# EAGLE design SmoothieDriver-DC3 (EAGLE 6.3)
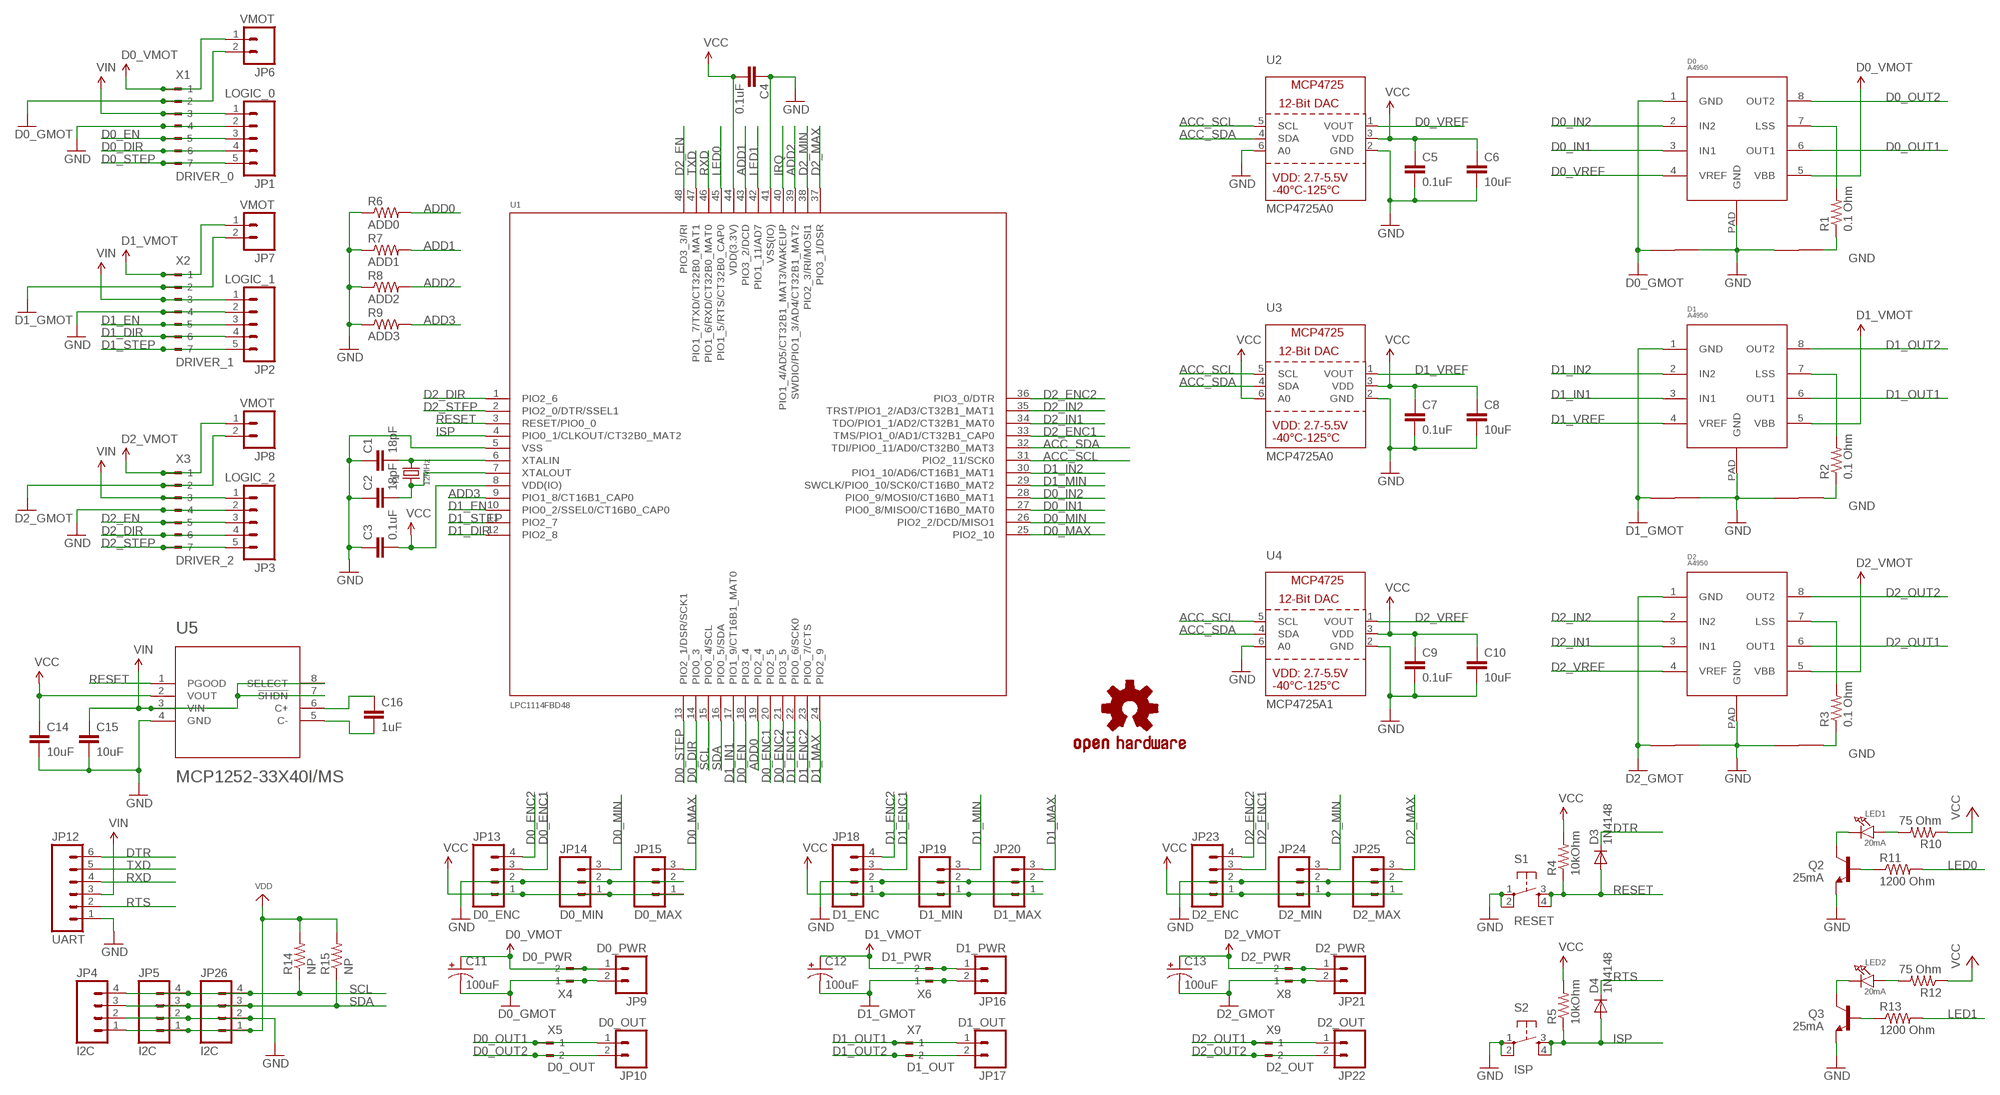
[diagram p0: schematic, sheet 1]

## Parts
C1  18pF  CAP0603-CAP  [0603-CAP]
C2  18pF  CAP0603-CAP  [0603-CAP]
C3  0.1uF  CAP0603-CAP  [0603-CAP]
C4  0.1uF  CAP0603-CAP  [0603-CAP]
C5  0.1uF  CAP0603-CAP  [0603-CAP]
C6  10uF  CAP0603-CAP  [0603-CAP]
C7  0.1uF  CAP0603-CAP  [0603-CAP]
C8  10uF  CAP0603-CAP  [0603-CAP]
C9  0.1uF  CAP0603-CAP  [0603-CAP]
C10  10uF  CAP0603-CAP  [0603-CAP]
C11  100uF  CAP_POLE  [PANASONIC_E]
C12  100uF  CAP_POLE  [PANASONIC_E]
C13  100uF  CAP_POLE  [PANASONIC_E]
C14  10uF  CAP1206  [1206]
C15  10uF  CAP1206  [1206]
C16  1uF  CAP0805  [0805]
D0  A4950  [SOICN8-PAD]
D0_GMOT  NET_LINK  [NET_LINK]
D1  A4950  [SOICN8-PAD]
D2  A4950  [SOICN8-PAD]
D3  1N4148  DIODESOD523  [SOD523]
D4  1N4148  DIODESOD523  [SOD523]
JP1  LOGIC_0  M05PTH  [1X05]
JP2  LOGIC_1  M05PTH  [1X05]
JP3  LOGIC_2  M05PTH  [1X05]
JP4  I2C  M04PTH  [1X04]
JP5  I2C  M04PTH  [1X04]
JP6  VMOT  M02PTH  [1X02]
JP7  VMOT  M02PTH  [1X02]
JP8  VMOT  M02PTH  [1X02]
JP9  D0_PWR  M02PTH  [1X02]
JP10  D0_OUT  M02PTH  [1X02]
JP12  UART  M06SIP  [1X06]
JP13  D0_ENC  M04PTH  [1X04]
JP14  D0_MIN  M03PTH  [1X03]
JP15  D0_MAX  M03PTH  [1X03]
JP16  D1_PWR  M02PTH  [1X02]
JP17  D1_OUT  M02PTH  [1X02]
JP18  D1_ENC  M04PTH  [1X04]
JP19  D1_MIN  M03PTH  [1X03]
JP20  D1_MAX  M03PTH  [1X03]
JP21  D2_PWR  M02PTH  [1X02]
JP22  D2_OUT  M02PTH  [1X02]
JP23  D2_ENC  M04PTH  [1X04]
JP24  D2_MIN  M03PTH  [1X03]
JP25  D2_MAX  M03PTH  [1X03]
JP26  I2C  M04PTH  [1X04]
LED1  20mA  LED0805  [CHIPLED_0805]
LED2  20mA  LED0805  [CHIPLED_0805]
Q2  25mA  TRANSISTOR_NPNSOT23  [SOT23]
Q3  25mA  TRANSISTOR_NPNSOT23  [SOT23]
R1  0.1 Ohm  RESISTOR2512  [R2512]
R2  0.1 Ohm  RESISTOR2512  [R2512]
R3  0.1 Ohm  RESISTOR2512  [R2512]
R4  10kOhm  RESISTOR0603-RES  [0603-RES]
R5  10kOhm  RESISTOR0603-RES  [0603-RES]
R6  ADD0  RESISTOR0603-RES  [0603-RES]
R7  ADD1  RESISTOR0603-RES  [0603-RES]
R8  ADD2  RESISTOR0603-RES  [0603-RES]
R9  ADD3  RESISTOR0603-RES  [0603-RES]
R10  75 Ohm  R-US_R0603  [R0603]
R11  1200 Ohm  R-US_R0603  [R0603]
R12  75 Ohm  R-US_R0603  [R0603]
R13  1200 Ohm  R-US_R0603  [R0603]
R14  NP  RESISTOR0603-RES  [0603-RES]
R15  NP  RESISTOR0603-RES  [0603-RES]
S1  RESET  TAC_SWITCHSMD  [TACTILE_SWITCH_SMD]
S2  ISP  TAC_SWITCHSMD  [TACTILE_SWITCH_SMD]
U1  LPC1114FBD48  LPC1113/4_QFP_SQUARE  [LQFP48]
U2  MCP4725A0  DAC_MCP4725  [SOT23-6]
U3  MCP4725A0  DAC_MCP4725  [SOT23-6]
U4  MCP4725A1  DAC_MCP4725  [SOT23-6]
U5  MCP1252-33X40I/MS  MCP1253  [MSOP8_0.65MM]
U$15  OSHW-LOGOM  [OSHW-LOGO-M]
U$22  NET_LINK  [NET_LINK]
U$23  NET_LINK  [NET_LINK]
U$24  NET_LINK  [NET_LINK]
U$25  NET_LINK  [NET_LINK]
U$26  NET_LINK  [NET_LINK]
X1  DRIVER_0  180-7  [180-7]
X2  DRIVER_1  180-7  [180-7]
X3  DRIVER_2  180-7  [180-7]
X4  D0_PWR  180-2  [180-2]
X5  D0_OUT  180-2  [180-2]
X6  D1_PWR  180-2  [180-2]
X7  D1_OUT  180-2  [180-2]
X8  D2_PWR  180-2  [180-2]
X9  D2_OUT  180-2  [180-2]
Y1  12MHz  CRYSTALTHIN  [CRYSTAL_3.2X2.5]

## Nets
ACC_SCL: U1.31(PIO2_11/SCK0) U2.5(SCL) U3.5(SCL) U4.5(SCL)
ACC_SDA: U1.32(TDI/PIO0_11/AD0/CT32B0_MAT3) U2.4(SDA) U3.4(SDA) U4.4(SDA)
ADD0: R6.2 U1.19(PIO2_4)
ADD1: R7.2 U1.43(PIO3_2/DCD)
ADD2: R8.2 U1.39(SWDIO/PIO1_3/AD4/CT32B1_MAT2)
ADD3: R9.2 U1.9(PIO1_8/CT16B1_CAP0)
D0_DIR: JP1.4 U1.14(PIO0_3) X1.6
D0_EN: JP1.3 U1.18(PIO3_4) X1.5
D0_ENC1: JP13.3 U1.20(PIO2_5)
D0_ENC2: JP13.4 U1.21(PIO3_5)
D0_GMOT: C11.- D0.1(GND) D0_GMOT.P$1 JP6.2 JP9.2 X1.2 X4.1
D0_IN1: D0.3(IN1) U1.27(PIO0_8/MISO0/CT16B0_MAT0)
D0_IN2: D0.2(IN2) U1.28(PIO0_9/MOSI0/CT16B0_MAT1)
D0_LSS: D0.7(LSS) R1.2
D0_MAX: JP15.3 U1.25(PIO2_10)
D0_MIN: JP14.3 U1.26(PIO2_2/DCD/MISO1)
D0_OUT1: D0.6(OUT1) JP10.1 X5.1
D0_OUT2: D0.8(OUT2) JP10.2 X5.2
D0_STEP: JP1.5 U1.13(PIO2_1/DSR/SCK1) X1.7
D0_VMOT: C11.+ D0.5(VBB) JP6.1 JP9.1 X1.1 X4.2
D0_VREF: D0.4(VREF) U2.1(VOUT)
D1_DIR: JP2.4 U1.12(PIO2_8) X2.6
D1_EN: JP2.3 U1.10(PIO0_2/SSEL0/CT16B0_CAP0) X2.5
D1_ENC1: JP18.3 U1.22(PIO0_6/SCK0)
D1_ENC2: JP18.4 U1.23(PIO0_7/CTS)
D1_GMOT: C12.- D1.1(GND) JP7.2 JP16.2 U$23.P$1 X2.2 X6.1
D1_IN1: D1.3(IN1) U1.17(PIO1_9/CT16B1_MAT0)
D1_IN2: D1.2(IN2) U1.30(PIO1_10/AD6/CT16B1_MAT1)
D1_LSS: D1.7(LSS) R2.2
D1_LSS1: D2.7(LSS) R3.2
D1_MAX: JP20.3 U1.24(PIO2_9)
D1_MIN: JP19.3 U1.29(SWCLK/PIO0_10/SCK0/CT16B0_MAT2)
D1_OUT1: D1.6(OUT1) JP17.1 X7.1
D1_OUT2: D1.8(OUT2) JP17.2 X7.2
D1_STEP: JP2.5 U1.11(PIO2_7) X2.7
D1_VMOT: C12.+ D1.5(VBB) JP7.1 JP16.1 X2.1 X6.2
D1_VREF: D1.4(VREF) U3.1(VOUT)
D2_DIR: JP3.4 U1.1(PIO2_6) X3.6
D2_EN: JP3.3 U1.48(PIO3_3/RI) X3.5
D2_ENC1: JP23.3 U1.33(TMS/PIO1_0/AD1/CT32B1_CAP0)
D2_ENC2: JP23.4 U1.36(PIO3_0/DTR)
D2_GMOT: C13.- D2.1(GND) JP8.2 JP21.2 U$26.P$1 X3.2 X8.1
D2_IN1: D2.3(IN1) U1.34(TDO/PIO1_1/AD2/CT32B1_MAT0)
D2_IN2: D2.2(IN2) U1.35(TRST/PIO1_2/AD3/CT32B1_MAT1)
D2_MAX: JP25.3 U1.37(PIO3_1/DSR)
D2_MIN: JP24.3 U1.38(PIO2_3/RI/MOSI1)
D2_OUT1: D2.6(OUT1) JP22.1 X9.1
D2_OUT2: D2.8(OUT2) JP22.2 X9.2
D2_STEP: JP3.5 U1.2(PIO2_0/DTR/SSEL1) X3.7
D2_VMOT: C13.+ D2.5(VBB) JP8.1 JP21.1 X3.1 X8.2
D2_VREF: D2.4(VREF) U4.1(VOUT)
DTR: D3.C JP12.6
GND: C1.1 C2.1 C3.1 C4.1 C5.2 C6.2 C7.2 C8.2 C9.2 C10.2 C14.2 C15.2 D0.PAD(GND) D0_GMOT.P$2 D1.PAD(GND) D2.PAD(GND) JP1.2 JP2.2 JP3.2 JP4.2 JP5.2 JP12.1 JP13.2 JP14.2 JP15.2 JP18.2 JP19.2 JP20.2 JP23.2 JP24.2 JP25.2 JP26.2 Q2.2(E) Q3.2(E) R1.1 R2.1 R3.1 R6.1 R7.1 R8.1 R9.1 S1.1 S1.2 S2.1 S2.2 U1.5(VSS) U1.41(VSS(IO)) U2.2(GND) U2.6(A0) U3.2(GND) U4.2(GND) U4.6(A0) U5.4(GND) U$22.P$1 U$22.P$2 U$23.P$2 U$24.P$1 U$24.P$2 U$25.P$1 U$25.P$2 U$26.P$2 X1.4 X2.4 X3.4
IRQ: U1.40(PIO1_4/AD5/CT32B1_MAT3/WAKEUP)
ISP: D4.A R5.1 S2.3 S2.4 U1.4(PIO0_1/CLKOUT/CT32B0_MAT2)
LED0: R11.2 U1.45(PIO1_5/RTS/CT32B0_CAP0)
LED1: R13.2 U1.42(PIO1_11/AD7)
N$1: LED1.A R10.2
N$2: LED1.C Q2.3(C)
N$6: Q2.1(B) R11.1
N$7: Q3.1(B) R13.1
N$9: LED2.A R12.2
N$10: LED2.C Q3.3(C)
PWRREG_C+: C16.1 U5.6(C+)
PWRREG_C-: C16.2 U5.5(C-)
RESET: D3.A R4.1 S1.3 S1.4 U1.3(RESET/PIO0_0) U5.1(PGOOD)
RTS: D4.C JP12.2
RXD: JP12.4 U1.46(PIO1_6/RXD/CT32B0_MAT0)
SCL: JP4.4 JP5.4 JP26.4 R14.1 U1.15(PIO0_4/SCL)
SDA: JP4.3 JP5.3 JP26.3 R15.1 U1.16(PIO0_5/SDA)
TXD: JP12.5 U1.47(PIO1_7/TXD/CT32B0_MAT1)
VCC: C3.2 C4.2 C5.1 C6.1 C7.1 C8.1 C9.1 C10.1 C14.1 JP13.1 JP14.1 JP15.1 JP18.1 JP19.1 JP20.1 JP23.1 JP24.1 JP25.1 R4.2 R5.2 R10.1 R12.1 U1.8(VDD(IO)) U1.44(VDD(3.3V)) U2.3(VDD) U3.3(VDD) U3.6(A0) U4.3(VDD) U5.2(VOUT)
VDD: JP4.1 JP5.1 JP26.1 R14.2 R15.2
VIN: C15.1 JP1.1 JP2.1 JP3.1 JP12.3 U5.3(VIN) U5.7(!SHDN) U5.8(SELECT) X1.3 X2.3 X3.3
XTALIN: C1.2 U1.6(XTALIN) Y1.2
XTALOUT: C2.2 U1.7(XTALOUT) Y1.1

## Library data of the parts
C1-C10 C14-C16 = SparkFun-Capacitors:CAP: Capacitor Standard 0603 ceramic capacitor, and 0.1" leaded capacitor.
C11-C13 = SparkFun-Capacitors:CAP_POL: Capacitor Polarized These are standard SMD and PTH capacitors. Normally 10uF, 47uF, and 100uF in electrolytic and tantalum varieties. Always verify the external diameter of the through hole cap, it varies with capacity, voltage, and manufacturer. The EIA devices should be standard.
D0 D1 D2 = logxen:A4950
D0_GMOT U$22-U$26 = logxen:NET_LINK
D3 D4 = SparkFun-DiscreteSemi:DIODE: Diode These are standard reverse protection diodes and small signal diodes. SMA package can handle up to about 1A. SOD-323 can handle about 200mA. What the SOD-323 package when ordering, there are some mfgs out there that are 5-pin packages.
JP1-JP3 = SparkFun-Connectors:M05: Header 5 Standard 5-pin 0.1" header. Use with straight break away headers (SKU : PRT-00116), right angle break away headers (PRT-00553), swiss pins (PRT-00743), machine pins (PRT-00117), and female headers (PRT-00115). Molex polarized connector foot print use with SKU : PRT-08230 with associated crimp pins and housings.
JP4 JP5 JP13 JP18 JP23 JP26 = SparkFun-Connectors:M04: Header 4 Standard 4-pin 0.1" header. Use with straight break away headers (SKU : PRT-00116), right angle break away headers (PRT-00553), swiss pins (PRT-00743), machine pins (PRT-00117), and female headers (PRT-00115). Molex polarized connector foot print use with SKU : PRT-08231 with associated crimp pins and housings. 1MM SMD Version SKU: PRT-10208
JP6-JP10 JP16 JP17 JP21 JP22 = SparkFun-Connectors:M02: Header 2 Standard 2-pin 0.1" header. Use with straight break away headers (SKU : PRT-00116), right angle break away headers (PRT-00553), swiss pins (PRT-00743), machine pins (PRT-00117), and female headers (PRT-00115). Molex polarized connector foot print use with SKU : PRT-08233 with associated crimp pins and housings.
JP12 = SparkFun-Connectors:M06: Header 6 Standard 6-pin 0.1" header. Use with straight break away headers (SKU : PRT-00116), right angle break away headers (PRT-00553), swiss pins (PRT-00743), machine pins (PRT-00117), and female headers (PRT-00115). Molex polarized connector foot print use with SKU : PRT-08094 with associated crimp pins and housings. NOTES ON THE VARIANTS LOCK and LOCK_LONGPADS... This footprint was designed to help hold the alignment of a through-hole component (i.e. 6-pin header) while soldering it into place. You may notice that each hole has been shifted either up or down by 0.005 of an inch from it's more standard position (which is a perfectly straight line). This slight alteration caused the pins (the squares in the middle) to touch the edges of the holes. Because they are alternating, it causes a "brace" to hold the component in place. 0.005 has proven to be the perfect amount of "off-center" position when using our standard breakaway headers. Although looks a little odd when you look at the bare footprint, once you have a header in there, the alteration is very hard to notice. Also, if you push a header all the way into place, it is covered up entirely on the bottom side. This idea of altering the position of holes to aid alignment will be further integrated into the Sparkfun Library for other footprints. It can help hold any component with 3 or more connection pins.
JP14 JP15 JP19 JP20 JP24 JP25 = SparkFun-Connectors:M03: Header 3 Standard 3-pin 0.1" header. Use with straight break away headers (SKU : PRT-00116), right angle break away headers (PRT-00553), swiss pins (PRT-00743), machine pins (PRT-00117), and female headers (PRT-00115). Molex polarized connector foot print use with SKU : PRT-08232 with associated crimp pins and housings.
LED1 LED2 = microbuilder:LED: LED 0603 - 0603 Surface Mount Package 2mA: Green LED - Low Power (3.9mcd, 2ma, 1.7Vf) - Digikey: 475-2709-2-ND Orange LED - Low Power (9.8mcd, 2ma, 1.8Vf) - Digikey: 475-1194-2-ND Red LED - Low Power (5mcd, 2ma, 1.8Vf) - Digikey: 475-1195-2-ND Yellow LED - Low Power (7mcd, 2ma, 1.8Vf) - Digikey: 475-1196-2-ND 5mA: Blue LED - Low Power (17mcd, 5ma, 2.9Vf) - Digikey: LNJ937W8CRACT-ND 0805 - 0805 Surface Mount Package 2mA: Red LED (8.8mcd, 2mA, 1.8Vf, Clear) - Low Power [Digikey: 475-2510-1-ND] Green LED (5mcd, 2mA, 1.8Vf, Clear) - Low Power [Digikey: 475-2730-1-ND] Yellow LED (11.3mcd, 2mA, 1.8Vf, Clear) - Low Power [Digikey: 475-2555-1-ND] 20mA: Red LED (104mcd, 20mA, Diffused) - LS R976 [Digikey: 475-1278-6-ND] Red LED (12mcd, 20mA, 2.0Vf, Clear) - APT2012EC [Digikey: 754-1128-1-ND] Green LED (15mcd, 20mA, 2.2Vf, Clear) - APT2012GC [Digikey: 754-1131-1-ND] Orange LED (160mcd, 20mA, 2.1Vf, Clear) - APT2012SECK [Digikey: 754-1130-1-ND] 1206 - 1206 Surface Mount Package Green LED (26mcd, 20mA, Diffused) - LG N971 [Digikey: 475-1407-6-ND] Red LED (15mcd, 20mA, Diffused) - LH N974 [Digikey: 475-1416-6-ND]
Q2 Q3 = SparkFun:TRANSISTOR_NPN: Transistor NPN BJT configuration in SOT23 package. MMBT2222 is the common NPN we use. Double check BCE configuration again layout.
R1-R9 R14 R15 = SparkFun-Resistors:RESISTOR: Resistor Basic schematic elements and footprints for 0603, 1206, and PTH resistors.
R10-R13 = rcl:R-US_: RESISTOR, American symbol
S1 S2 = SparkFun-Electromechanical:TAC_SWITCH: Momentary Switch Button commonly used for reset or general input. Spark Fun Electronics SKU : COM-00097
U1 = microbuilder:LPC1113/4_QFP_SQUARE: LPC1113/4 QFP This is the same chip used in the LPC1113/4 footprint, but the schematic symbol is a square corresponding to the same pinout used on the LQFP48 IC. This alternate layout can be useful when designing space-constrained devices, and to minimise the number of vias on a board.
U2-U4 = microbuilder:DAC_MCP4725: MCP4725 - 12-Bit I2C DAC with on-board EEPROM Settling Time: 6 µs 2.7-5.5V Supply 100kHz, 400kHz, 3.4 Mbps I²C EEPROM can be used to store a specific output voltage which will be set coming out of reset I²C Address: 1100 A2 A1 A0 A0 is set via the A0 pin, A2 and A1 are hard-wired on the chip depending on the model chosen: Part Number A2 A1 Code MCP4725A0T-E/CH 0 0 AJNN MCP4725A1T-E/CH 0 1 APNN MCP4725A2T-E/CH 1 0 AQNN MCP4725A3T-E/CH 1 1 ARNN
U5 = logxen:MCP1253
U$15 = SparkFun-Aesthetics:OSHW-LOGO: Open Source Hardware Logo This logo indicates the piece of hardware it is found on incorporates a OSHW license and/or adheres to the definition of open source hardware found here: http://freedomdefined.org/OSHW
X1-X3 = con-weidmueller-sl35:180-7: WEIDMUELLER CLAMP CONNECTOR; OC_FARNELL: unknown; OC_NEWARK: unknown
X4-X9 = con-weidmueller-sl35:180-2: WEIDMUELLER CLAMP CONNECTOR; OC_FARNELL: unknown; OC_NEWARK: unknown
Y1 = microbuilder:CRYSTAL: Crystals HC49UP - Surface Mount Crystal 4.0MHz 18pF +/-30ppm Surface Mount Crystal [Digikey: 535-9857-1-ND] 12.0 MHz Surface Mount Crystal [Digikey: 535-9869-6-ND] 25.0 MHz Surface Mount Crystal [Digikey: 535-9078-1-ND] 2.5 x 2.0mm - MEMs SMT Crystal 16.0 MHz 10pF 20ppm 2.5 x 2.0mm Crystal [Digikey -40-85°C: 535-10923-1-ND] 3.2 x 2.5mm - MEMs SMT Crystal 12.0 MHz 8pF 15ppm 3.2 x 2.5mm Crystal [Digikey: -10-70°C: 644-1047-1-ND -40-125°C: 644-1128-1-ND] 16.0 MHz 8pF 15ppm 3.2 x 2.5mm Crystal [Digikey: -10-70°C: 644-1049-1-ND -40-125°C: 644-1129-2-ND] 16.0 MHz 10pF 10ppm 3.2 x 2.5mm Crystal [Digikey: 644-1100-1-ND] 27.12 MHz 18pF 30ppm 3.2 x 2.5mm Crystal [Digikey: 887-1424-1-ND] 27.12MHz 10pF 10ppm 3.2 x 2.5mm Crystal [Digikey: 887-1329-1-ND] 4.9 x 1.8mm - MEMs SMT Crystal 32.768 KHz 12.5pF 20ppm 4.9 x 1.8mm Crystal [Digikey: SE2415CT-ND] 8.0 x 3.8mm - Surface Mount Crystal 32.768kHz 12.5pF 20ppm -40°C-85°C [Digikey: 535-9166-2-ND] Cylinder 32.768KHz Cylinder Crystal (2x6mm body) [Ex. Digikey: 300-8341-2-ND]

## Board
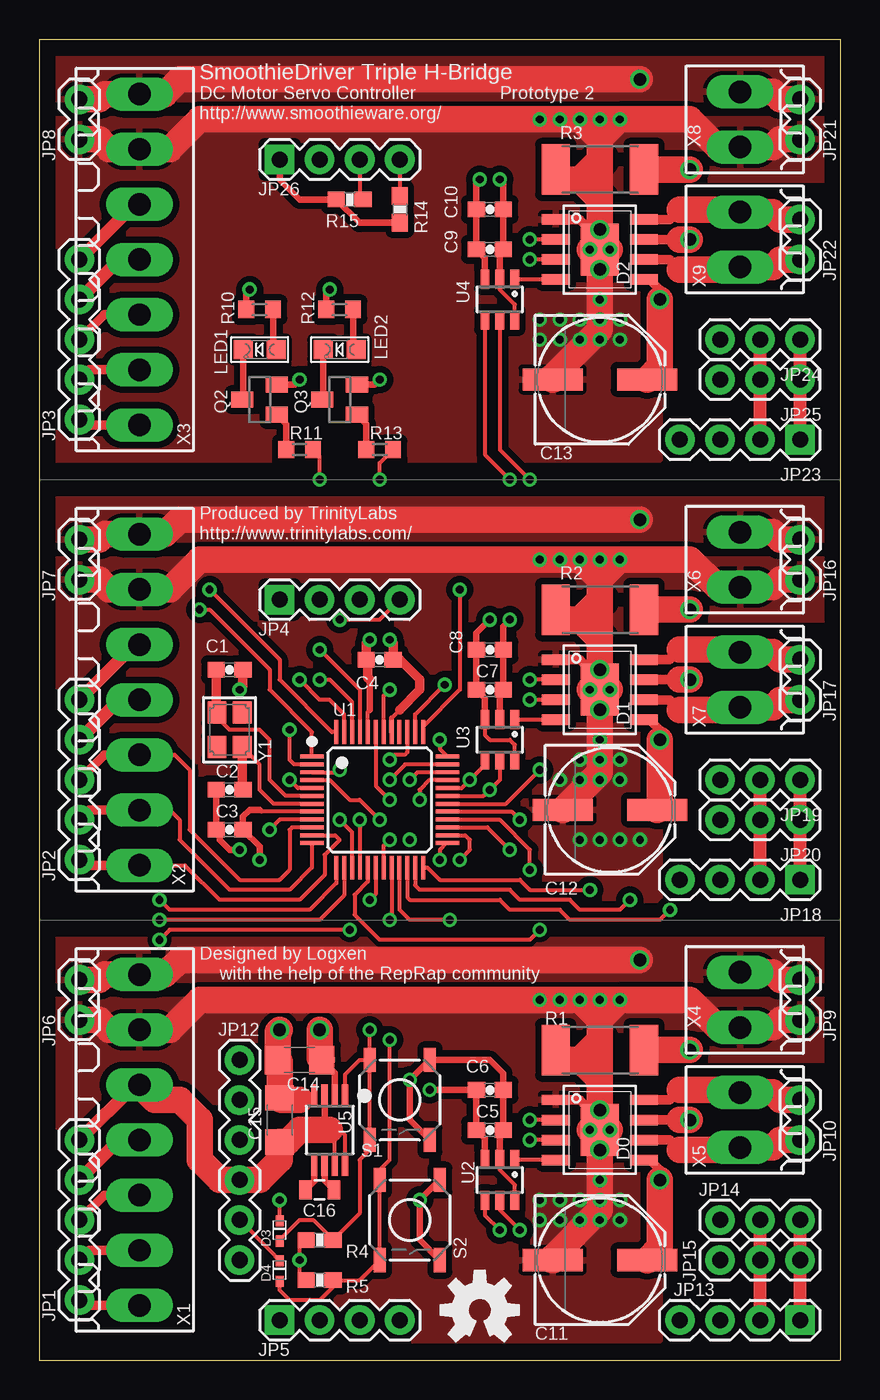
[diagram p1: board, top side]
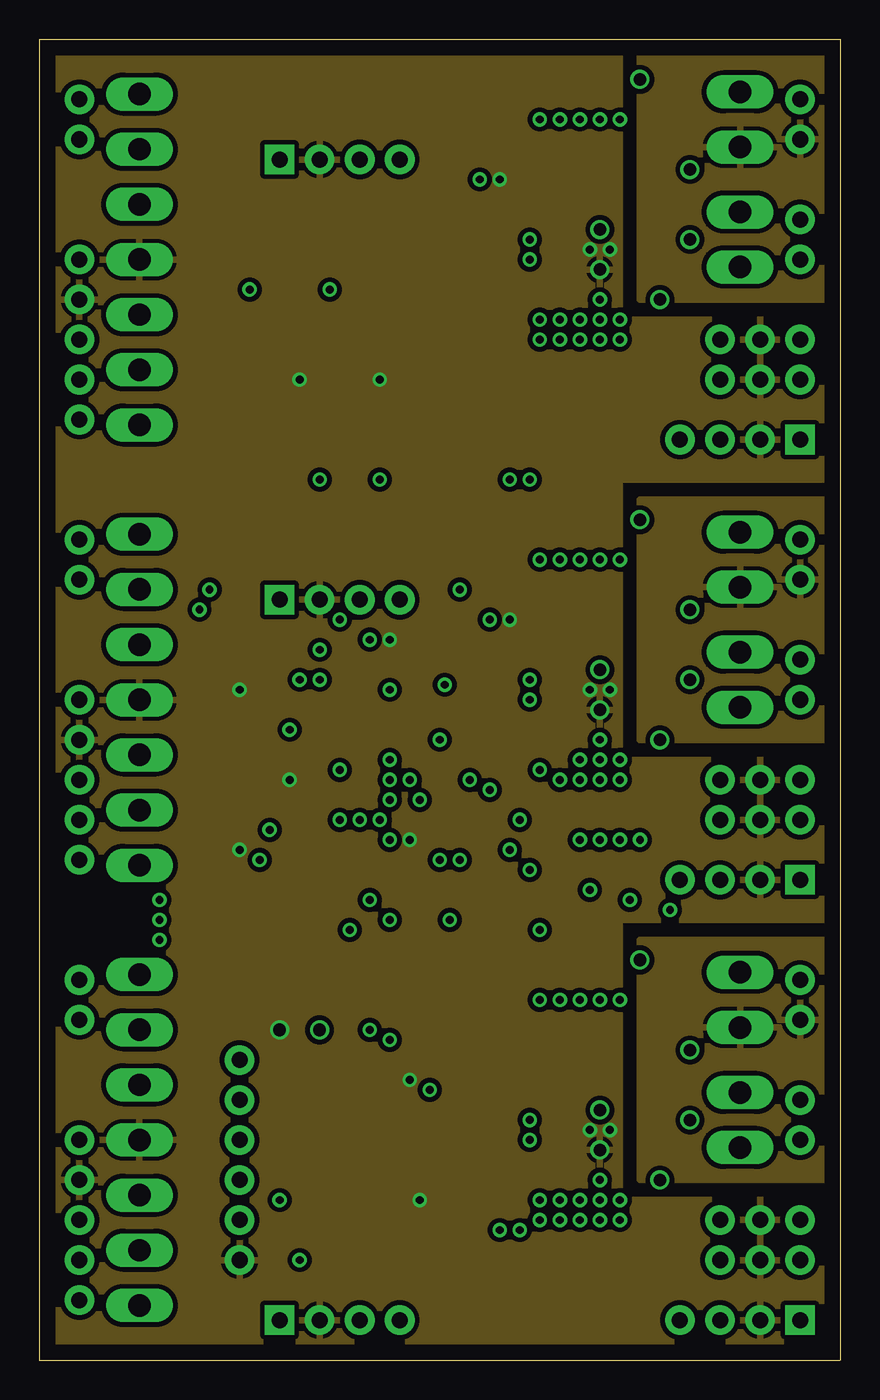
[diagram p2: board, inner layer Route2]
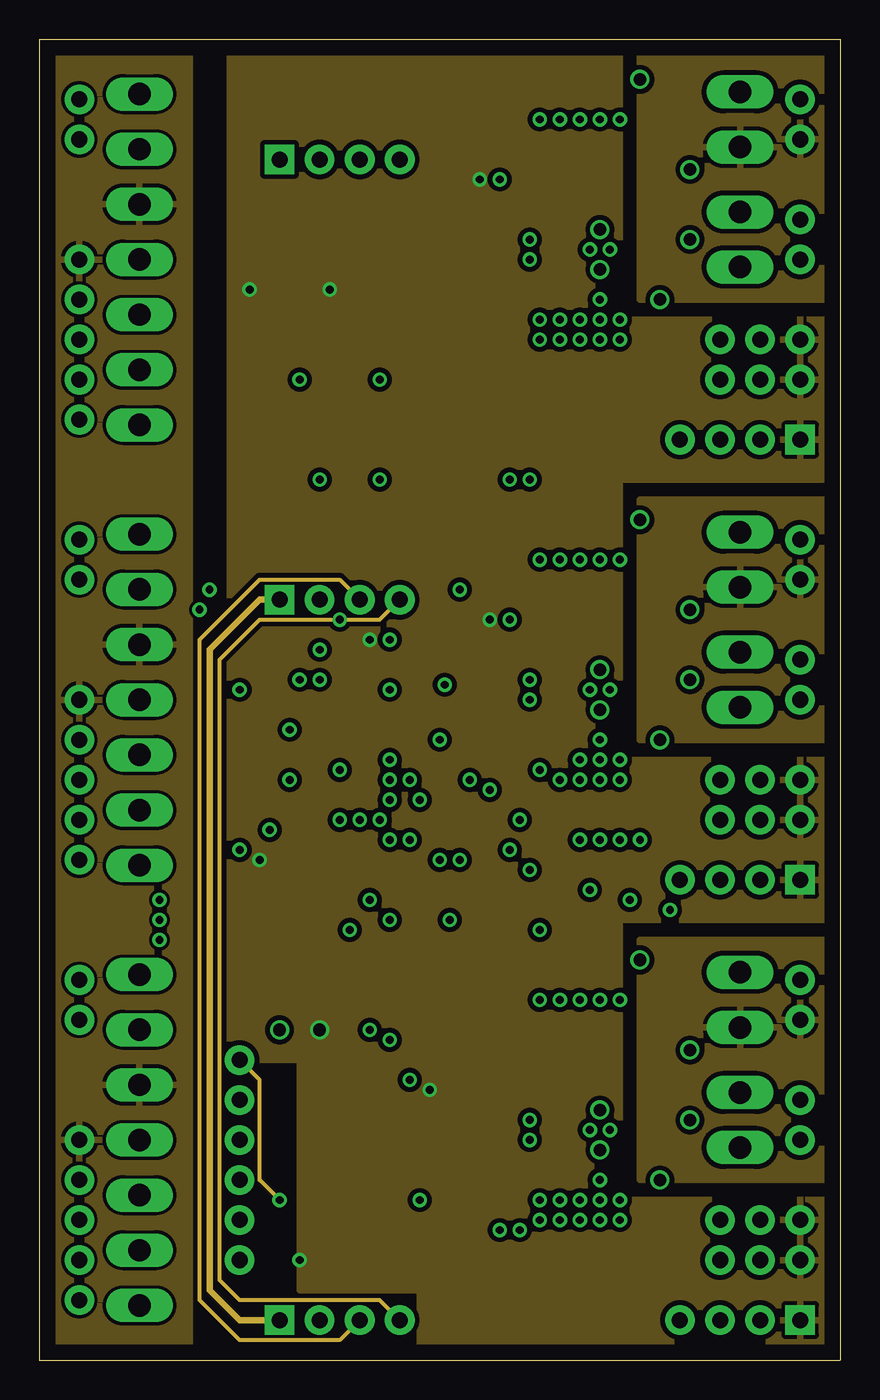
[diagram p3: board, inner layer Route3]
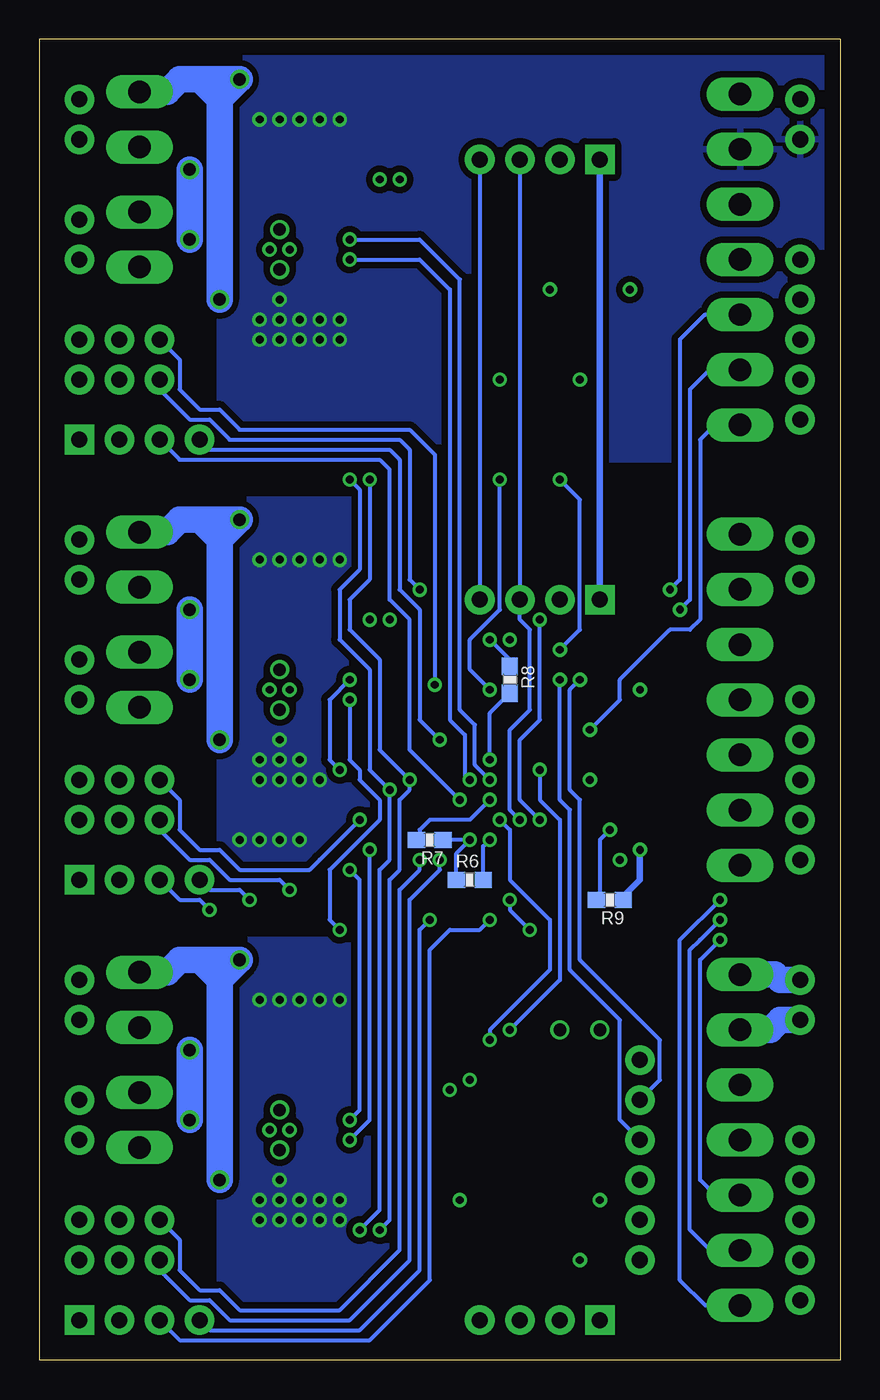
[diagram p4: board, bottom side, seen from below]

Size 50.8 x 83.82 mm. Coordinates in mm from the lower left corner, seen from the top.
Outline: 50.78,0 0,0 0,83.82 50.8,83.82 50.8,0
Copper layers (1*2*3*16): Top 0.035mm / dielectric 0.5mm / Route2 0.017mm / dielectric 0.5mm / Route3 0.017mm / dielectric 0.5mm / Bottom 0.035mm
Design rules "default *": minimum track width 8mil, minimum drill 19mil, track to track 8mil, track to pad 8mil, pad to pad 8mil, via to via 8mil, smd to smd 0mil, copper to edge 40mil, drill to drill 8mil, minimum pad ring 8mil, minimum via ring 8mil, stop-mask expansion 4mil, vias tented up to drill 0mil, thermal gap 10mil

### Footprints (pad centres in the part's own frame; a part is rotated, then mirrored left to right if it is on the bottom)
0603-CAP = smd 1.1 x 1: 1 -0.85,0; 2 0.85,0
PANASONIC_E = smd 3.8 x 1.4: + 3,0; - -3,0
1206 = smd 1.6 x 1.8: 1 -1.4,0; 2 1.4,0
0805 = smd 0.8 x 1.2: 1 -0.9,0; 2 0.9,0
SOICN8-PAD = smd 0.65 x 1.75: 1 -1.905,-2.8; 2 -0.635,-2.8; 3 0.635,-2.8; 4 1.905,-2.8; 5 1.905,2.8; 6 0.635,2.8; 7 -0.635,2.8; 8 -1.905,2.8 | smd 3.3 x 2.41: PAD 0,0
NET_LINK = drill 0.8: P$1 0,0; P$2 0,0
SOD523 = smd 0.7 x 0.5: A 0.7,0; C -0.6,0
1X05 = drill 1.016 pad 1.88: 1 0,0; 2 2.54,0; 3 5.08,0; 4 7.62,0; 5 10.16,0
1X04 = drill 1.016 pad 1.88 square: 1 0,0 | drill 1.016 pad 1.88: 2 2.54,0; 3 5.08,0; 4 7.62,0
1X02 = drill 1.016 pad 1.88: 1 0,0; 2 2.54,0
1X06 = drill 1.016 pad 1.88: 1 0,0; 2 2.54,0; 3 5.08,0; 4 7.62,0; 5 10.16,0; 6 12.7,0
1X03 = drill 1.016 pad 1.88: 1 0,0; 2 2.54,0; 3 5.08,0
CHIPLED_0805 = smd 1.2 x 1.2: A 0,-1.05; C 0,1.05
SOT23 = smd 1 x 1.4: 1 -0.95,-1.1; 2 0.95,-1.1; 3 0,1.1
R2512 = smd 1.8 x 3.2: 1 -2.8,0; 2 2.8,0
0603-RES = smd 1.1 x 1: 1 -0.85,0; 2 0.85,0
R0603 = smd 1 x 1.1: 1 -0.85,0; 2 0.85,0
TACTILE_SWITCH_SMD = smd 1.524 x 0.762: 1 -2.54,1.905; 2 2.54,1.905; 3 -2.54,-1.905; 4 2.54,-1.905
LQFP48 = smd 1.5 x 0.25: 1 -4.3,2.75; 2 -4.3,2.25; 3 -4.3,1.75; 4 -4.3,1.25; 5 -4.3,0.75; 6 -4.3,0.25; 7 -4.3,-0.25; 8 -4.3,-0.75; 9 -4.3,-1.25; 10 -4.3,-1.75; 11 -4.3,-2.25; 12 -4.3,-2.75; 25 4.3,-2.75; 26 4.3,-2.25; 27 4.3,-1.75; 28 4.3,-1.25; 29 4.3,-0.75; 30 4.3,-0.25; 31 4.3,0.25; 32 4.3,0.75; 33 4.3,1.25; 34 4.3,1.75; 35 4.3,2.25; 36 4.3,2.75 | smd 0.25 x 1.5: 13 -2.75,-4.3; 14 -2.25,-4.3; 15 -1.75,-4.3; 16 -1.25,-4.3; 17 -0.75,-4.3; 18 -0.25,-4.3; 19 0.25,-4.3; 20 0.75,-4.3; 21 1.25,-4.3; 22 1.75,-4.3; 23 2.25,-4.3; 24 2.75,-4.3; 37 2.75,4.3; 38 2.25,4.3; 39 1.75,4.3; 40 1.25,4.3; 41 0.75,4.3; 42 0.25,4.3; 43 -0.25,4.3; 44 -0.75,4.3; 45 -1.25,4.3; 46 -1.75,4.3; 47 -2.25,4.3; 48 -2.75,4.3
SOT23-6 = smd 0.55 x 1.2: 1 -0.95,-1.3; 2 0,-1.3; 3 0.95,-1.3; 4 0.95,1.3; 5 0,1.3; 6 -0.95,1.3
MSOP8_0.65MM = smd 0.4 x 1.4: 1 -0.975,-2.2; 2 -0.325,-2.2; 3 0.325,-2.2; 4 0.975,-2.2; 5 0.975,2.2; 6 0.325,2.2; 7 -0.325,2.2; 8 -0.975,2.2
180-7 = drill 1.422 long: 1 -10.5,0; 2 -7,0; 3 -3.5,0; 4 0,0; 5 3.5,0; 6 7,0; 7 10.5,0
180-2 = drill 1.422 long: 1 -1.75,0; 2 1.75,0
CRYSTAL_3.2X2.5 = smd 1.4 x 1.2: 1 -1.1,-0.8; 2 1.1,0.8; GND1 -1.1,0.8; GND2 1.1,-0.8

### Placement (x,y rotation side)
C1  12.06,43.81 180 top
C2  12.06,36.2 0 top
C3  12.06,33.66 0 top
C4  21.59,44.45 180 top
C5  28.57,14.61 0 top
C6  28.57,17.14 0 top
C7  28.57,42.55 0 top
C8  28.57,45.09 0 top
C9  28.57,70.48 0 top
C10  28.57,73.03 0 top
C11  35.56,6.35 0 top
C12  36.2,34.92 0 top
C13  35.56,62.23 0 top
C14  16.51,19.05 180 top
C15  15.24,15.24 90 top
C16  17.78,10.79 180 top
D0  35.56,14.61 270 top
D0_GMOT  35.56,15.88 0 top
D1  35.56,42.55 270 top
D2  35.56,70.48 270 top
D3  15.24,8.26 270 top
D4  15.24,5.71 270 top
JP1  2.54,13.97 270 top
JP2  2.54,41.91 270 top
JP3  2.54,69.85 270 top
JP4  15.24,48.26 0 top
JP5  15.24,2.54 0 top
JP6  2.54,24.13 270 top
JP7  2.54,52.07 270 top
JP8  2.54,80.01 270 top
JP9  48.26,24.13 270 top
JP10  48.26,13.97 90 top
JP12  12.7,6.35 90 top
JP13  48.26,2.54 180 top
JP14  48.26,8.89 180 top
JP15  48.26,6.35 180 top
JP16  48.26,52.07 270 top
JP17  48.26,41.91 90 top
JP18  48.26,30.48 180 top
JP19  48.26,36.83 180 top
JP20  48.26,34.29 180 top
JP21  48.26,80.01 270 top
JP22  48.26,69.85 90 top
JP23  48.26,58.42 180 top
JP24  48.26,64.77 180 top
JP25  48.26,62.23 180 top
JP26  15.24,76.2 0 top
LED1  13.97,64.14 90 top
LED2  19.05,64.14 90 top
Q2  13.97,60.96 90 top
Q3  19.05,60.96 90 top
R1  35.56,19.68 0 top
R2  35.56,47.62 0 top
R3  35.56,75.56 0 top
R4  17.78,7.62 180 top
R5  17.78,5.08 180 top
R6  23.5,30.48 0 bottom
R7  26.04,33.02 180 bottom
R8  20.95,43.18 270 bottom
R9  14.61,29.21 180 bottom
R10  13.97,66.67 0 top
R11  16.51,57.78 0 top
R12  19.05,66.67 0 top
R13  21.59,57.78 0 top
R14  22.86,73.03 270 top
R15  19.68,73.66 180 top
S1  22.86,16.51 270 top
S2  23.5,8.89 270 top
U1  21.59,35.56 0 top
U2  29.21,11.43 180 top
U3  29.21,39.37 180 top
U4  29.21,67.31 180 top
U5  18.41,14.61 180 top
U$15  27.94,3.17 0 top
U$22  35.56,13.34 180 bottom
U$23  35.56,43.81 0 top
U$24  35.56,41.27 0 top
U$25  35.56,69.22 0 top
U$26  35.56,71.75 0 top
X1  6.35,13.97 270 top
X2  6.35,41.91 270 top
X3  6.35,69.85 270 top
X4  44.45,22.86 90 top
X5  44.45,15.24 90 top
X6  44.45,50.8 90 top
X7  44.45,43.18 90 top
X8  44.45,78.74 90 top
X9  44.45,71.12 90 top
Y1  12.06,40.01 90 top

### Tracks (layer width: path | path; a pad name or v marks a point on that pad's centre or on a via)
ACC_SCL  (via drill 0.5)
  Top 0.254: U4.5 29.21,57.78 v31.11,55.88 | U2.5 29.21,9.53 v30.48,8.26 | U1.31 28.19,35.81 v28.57,36.2 29.21,36.83 U3.5
  Bottom 0.254: v30.48,8.26 29.21,9.53 29.21,31.11 28.57,31.75 v28.57,36.2 29.84,37.47 29.84,43.81 31.75,45.72 31.75,48.9 30.48,50.16 30.48,55.24 v31.11,55.88
ACC_SDA  (via drill 0.5)
  Top 0.254: U4.4 28.26,57.47 v29.84,55.88 | U2.4 28.26,9.21 v29.21,8.26 | U3.4 28.26,37.78 v27.3,36.83 26.79,36.31 U1.32
  Bottom 0.254: v29.21,8.26 28.57,8.89 28.57,30.48 27.94,31.11 27.94,35.56 27.3,36.2 v27.3,36.83 29.21,38.73 29.21,44.45 31.11,46.35 31.11,48.26 29.84,49.53 v29.84,55.88
ADD0  (via drill 0.5)
  Top 0.254: U1.19 21.84,32.63 v22.23,33.02
  Bottom 0.254: 22.86,30.7 R6.2 22.64,32.6 v22.23,33.02
ADD1  (via drill 0.5)
  Top 0.254: U1.43 21.34,36.45 v22.23,35.56
  Bottom 0.254: v22.23,35.56 23.5,34.29 26.04,34.29 26.67,33.66 26.67,33.23 R7.2
ADD2  (via drill 0.5)
  Top 0.254: U1.39 23.34,38.58 23.18,38.42 22.54,38.42 v22.23,38.1
  Bottom 0.254: v22.23,38.1 22.23,41.06 R8.2
ADD3  (via drill 0.5)
  Top 0.254: U1.9 15.26,34.31 v14.61,33.66
  Bottom 0.254: v14.61,33.66 15.24,33.02 15.24,29.43 R9.2
D0_DIR  (via drill 0.5)
  Top 0.254: U1.14 19.34,29.5 17.78,27.94 v7.62,27.94
  Top 0.61: X1.6 3.16,6.97 JP1.4
  Bottom 0.254: X1.6 8.24,6.97 9.53,8.26 9.53,26.04 8.89,26.67 v7.62,27.94
D0_EN  (via drill 0.5)
  Top 0.254: U1.18 21.34,29.59 v20.95,29.21 | v19.68,27.3 8.26,27.3 v7.62,26.67
  Top 0.61: X1.5 4.12,10.47 JP1.3
  Bottom 0.254: X1.5 7.93,10.47 8.89,11.43 8.89,25.4 v7.62,26.67 | v20.95,29.21 20.95,28.57 v19.68,27.3
D0_ENC1  (via drill 0.5)
  Top 0.254: U1.20 22.34,28.05 v22.23,27.94
  Bottom 0.254: JP13.3 41.91,1.27 29.84,1.27 26.04,5.08 26.04,26.04 24.77,27.3 22.86,27.3 v22.23,27.94
D0_ENC2  (via drill 0.5)
  Top 0.254: v26.04,27.94 23.5,27.94 22.84,28.59 U1.21
  Bottom 0.254: JP13.4 40.01,1.91 30.48,1.91 26.67,5.71 26.67,27.3 v26.04,27.94
D0_GMOT  (via drill 0.5)
  Top 0.61: D0.1 34.29,16.51 34.92,15.88 D0_GMOT.P$1
  Top 1.676: JP9.2 46.99,21.59 46.51,21.11 X4.1 43.02,21.11 41.27,22.86 v36.83,22.86 | JP6.2 3.81,21.59 4.43,20.97 X1.2 8.27,20.97 10.16,22.86 v31.75,22.86 v33.02,22.86 v34.29,22.86 | v34.29,22.86 v35.56,22.86 v36.83,22.86 | C11.- 32.56,6.53 35.56,9.53 v35.56,10.16 v35.56,11.43 D0_GMOT.P$1 35.56,21.59 | v36.83,22.86 35.56,21.59 | v34.29,22.86 35.56,21.59
  Bottom 1.676: X1.2 4.43,20.97 3.81,21.59 JP6.2
  other vias: 31.75,8.89 31.75,10.16 33.02,10.16 33.02,8.89 34.29,8.89 34.29,10.16 35.56,8.89 36.83,8.89 36.83,10.16
  pour Route2 (isolate 0.305): 38.1,26.67 52.07,26.67 52.07,11.43 38.1,11.43
  pour Route3 (isolate 0.305): 38.1,26.67 52.07,26.67 52.07,11.43 38.1,11.43
  pour Top (isolate 0.406): -1.27,22.86 52.07,22.86 52.07,19.05 39.37,19.05 39.37,1.27 -1.27,1.27
  pour Bottom (isolate 0.406): 26.67,26.67 39.37,26.67 39.37,1.27 26.67,1.27
D0_IN1  (via drill 0.5)
  Top 0.254: D0.3 v31.11,13.97 | v29.84,32.38 28.42,33.81 U1.27
  Bottom 0.254: v31.11,13.97 29.84,15.24 v29.84,32.38
D0_IN2  (via drill 0.5)
  Top 0.254: D0.2 v31.11,15.24 | v31.11,31.11 31.11,32.38 29.19,34.31 U1.28
  Bottom 0.254: v31.11,15.24 30.48,15.88 30.48,30.48 v31.11,31.11
D0_LSS  (via drill 0.8)
  Top 0.61: D0.7 40.64,15.24
  Top 1.676: 40.64,15.24 v41.27,15.24 | v41.27,19.68 R1.2
  Bottom 1.676: v41.27,15.24 v41.27,19.68
D0_MAX  (via drill 0.5)
  Top 0.254: U1.25 25.82,32.81 25.4,32.38 v25.4,31.75
  Bottom 0.254: JP15.3 43.18,5.71 41.27,3.81 40.01,3.81 38.73,2.54 31.11,2.54 27.3,6.35 27.3,29.21 25.4,31.11 v25.4,31.75
D0_MIN  (via drill 0.5)
  Top 0.254: v26.67,31.75 27.3,32.38 27.3,33.02 27.02,33.31 U1.26
  Bottom 0.254: JP14.3 41.91,7.62 41.91,5.71 40.64,4.45 39.37,4.45 38.1,3.17 31.75,3.17 27.94,6.99 27.94,29.84 26.67,31.11 v26.67,31.75
D0_OUT1
  Top 0.61: D0.6 40.01,13.97 40.64,13.34
  Top 1.676: 40.64,13.34 44.3,13.34 X5.1 46.51,13.49 46.99,13.97 JP10.1
D0_OUT2
  Top 0.61: D0.8 40.01,16.51 40.64,17.14
  Top 1.676: 40.64,17.14 44.3,17.14 X5.2 46.51,16.99 46.99,16.51 JP10.2
D0_STEP  (via drill 0.5)
  Top 0.254: U1.13 18.84,30.27 17.14,28.57 8.26,28.57 v7.62,29.21
  Top 0.61: X1.7 2.88,3.47 JP1.5
  Bottom 0.254: X1.7 8.55,3.47 10.16,5.08 10.16,26.67 v7.62,29.21
D0_VMOT  (via drill 0.8)
  Top 0.61: D0.5 38.73,12.7 39.37,12.06 v39.37,11.43
  Top 1.676: X4.2 46.51,24.61 46.99,24.13 JP9.1 | JP6.1 3.81,24.13 4.15,24.47 X1.1 7.96,24.47 8.89,25.4 v38.1,25.4 | v39.37,11.43 39.37,7.16 C11.+
  Bottom 1.676: X1.1 4.15,24.47 3.81,24.13 JP6.1 | X4.2 42.7,24.61 41.91,25.4 40.64,25.4 | 40.64,25.4 v38.1,25.4 39.37,24.13 | 40.64,25.4 39.37,24.13 | 39.37,24.13 v39.37,11.43
  pour Top (isolate 0.305): -1.27,24.13 -1.27,26.67 52.07,26.67 52.07,24.13
D0_VREF
  Top 0.254: D0.4 30.19,12.7 U2.1
D1_DIR
  Top 0.254: X2.6 8.27,34.91 8.89,34.29 8.89,33.02 12.06,29.84 15.88,29.84 17.29,31.26 U1.12
  Top 0.61: X2.6 3.16,34.91 JP2.4
D1_EN
  Top 0.254: X2.5 8.58,38.41 9.53,37.47 9.53,33.66 12.7,30.48 15.24,30.48 15.88,31.11 15.88,33.66 16.03,33.81 U1.10
  Top 0.61: X2.5 4.12,38.41 JP2.3
D1_ENC1  (via drill 0.5)
  Top 0.254: v40.01,28.57 39.37,27.94 33.66,27.94 33.02,28.57 29.84,28.57 29.21,29.21 23.5,29.21 23.34,29.36 U1.22
  Bottom 0.254: JP18.3 41.91,29.21 40.64,29.21 v40.01,28.57
D1_ENC2  (via drill 0.5)
  Top 0.254: v37.47,29.21 36.83,28.57 34.29,28.57 33.66,29.21 30.48,29.21 29.84,29.84 24.13,29.84 23.84,30.14 U1.23
  Bottom 0.254: JP18.4 40.01,29.84 38.1,29.84 v37.47,29.21
D1_GMOT  (via drill 0.5)
  Top 0.61: D1.1 34.29,44.45 34.92,43.81 U$23.P$1
  Top 1.676: JP7.2 3.81,49.53 4.43,48.91 X2.2 8.27,48.91 10.16,50.8 v31.75,50.8 v33.02,50.8 v34.29,50.8 | JP16.2 46.99,49.53 46.51,49.05 X6.1 43.02,49.05 41.27,50.8 v36.83,50.8 | v34.29,50.8 v35.56,50.8 v36.83,50.8 | v36.83,50.8 35.56,49.53 | v34.29,50.8 35.56,49.53 | 35.56,49.53 U$23.P$1 v35.56,39.37 v35.56,38.1 35.56,37.29 C12.-
  other vias: 33.02,36.83 34.29,36.83 34.29,38.1 35.56,36.83 36.83,38.1 36.83,36.83 34.29,33.02 35.56,33.02 36.83,33.02 38.1,33.02
  pour Route2 (isolate 0.305): 38.1,54.61 52.07,54.61 52.07,39.37 38.1,39.37
  pour Route3 (isolate 0.305): 38.1,54.61 52.07,54.61 52.07,39.37 38.1,39.37
  pour Top (isolate 0.406): -1.27,50.8 52.07,50.8 52.07,46.99 39.37,46.99 39.37,29.21 -1.27,29.21
  pour Bottom (isolate 0.406): 26.67,54.61 26.67,27.94 39.37,27.94 39.37,54.61
D1_IN1  (via drill 0.5)
  Top 0.254: D1.3 v31.11,41.91 | v31.75,27.3 31.11,26.67 21.59,26.67 20,28.26 20,29.53 20.84,30.36 U1.17
  Bottom 0.254: v31.11,41.91 31.11,38.1 30.48,37.47 30.48,36.83 29.21,35.56 29.21,34.29 32.38,31.11 32.38,27.94 v31.75,27.3
D1_IN2  (via drill 0.5)
  Top 0.254: D1.2 v31.11,43.18 | v31.75,37.47 29.59,35.31 U1.30
  Bottom 0.254: v31.11,43.18 32.38,41.91 32.38,38.1 v31.75,37.47
D1_LSS  (via drill 0.8)
  Top 0.61: D1.7 40.64,43.18
  Top 1.676: 40.64,43.18 v41.27,43.18 | v41.27,47.62 R2.2
  Bottom 1.676: v41.27,43.18 v41.27,47.62
D1_LSS1  (via drill 0.8)
  Top 0.61: D2.7 40.64,71.12
  Top 1.676: 40.64,71.12 v41.27,71.12 | v41.27,75.56 R3.2
  Bottom 1.676: v41.27,71.12 v41.27,75.56
D1_MAX  (via drill 0.5)
  Top 0.254: U1.24 24.62,31.26 25.4,30.48 30.48,30.48 31.11,29.84 v34.92,29.84
  Bottom 0.254: JP20.3 43.18,33.66 41.27,31.75 40.01,31.75 38.73,30.48 35.56,30.48 v34.92,29.84
D1_MIN  (via drill 0.5)
  Top 0.254: U1.29 29.96,34.81 v30.48,34.29
  Bottom 0.254: JP19.3 41.91,35.56 41.91,33.66 40.64,32.38 39.37,32.38 38.1,31.11 33.66,31.11 33.02,31.75 v30.48,34.29
D1_OUT1
  Top 0.61: D1.6 40.01,41.91 40.64,41.27
  Top 1.676: JP17.1 46.99,41.91 46.51,41.43 X7.1 44.3,41.27 40.64,41.27
D1_OUT2
  Top 0.61: D1.8 40.01,44.45 40.64,45.09
  Top 1.676: JP17.2 46.99,44.45 46.51,44.93 X7.2 44.3,45.09 40.64,45.09
D1_STEP
  Top 0.254: X2.7 9.23,31.41 11.43,29.21 16.51,29.21 18.1,30.8 18.1,32.07 19.05,33.02 18.76,33.31 U1.11
  Top 0.61: X2.7 2.88,31.41 JP2.5
D1_VMOT  (via drill 0.8)
  Top 0.61: D1.5 38.73,40.64 39.37,40.01 v39.37,39.37
  Top 1.676: JP7.1 3.81,52.07 4.15,52.41 X2.1 7.96,52.41 8.89,53.34 v38.1,53.34 | X6.2 46.51,52.55 46.99,52.07 JP16.1 | v39.37,39.37 39.37,35.1 C12.+
  Bottom 1.676: 40.64,53.34 v38.1,53.34 39.37,52.07 | X6.2 42.7,52.55 41.91,53.34 40.64,53.34 | 40.64,53.34 39.37,52.07 | 39.37,52.07 v39.37,39.37
  pour Top (isolate 0.305): -1.27,54.61 52.07,54.61 52.07,52.07 -1.27,52.07
D1_VREF
  Top 0.254: D1.4 30.19,40.64 U3.1
D2_DIR  (via drill 0.5)
  Top 0.254: v10.16,47.62 10.79,47.62 14.61,43.81 14.61,42.55 17.29,39.86 U1.1
  Top 0.61: X3.6 3.16,62.85 JP3.4
  Bottom 0.254: X3.6 8.27,62.85 9.53,61.59 9.53,48.26 v10.16,47.62
D2_EN  (via drill 0.5)
  Top 0.254: v10.79,48.9 15.24,44.45 15.24,43.18 18.56,39.86 U1.48
  Top 0.61: X3.5 4.12,66.35 JP3.3
  Bottom 0.254: X3.5 8.58,66.35 10.16,64.77 10.16,49.53 v10.79,48.9
D2_ENC1  (via drill 0.5)
  Top 0.254: U1.33 24.75,36.81 24.13,36.2 v24.13,35.56
  Bottom 0.254: JP23.3 41.91,57.15 29.21,57.15 28.57,56.52 28.57,48.26 27.3,46.99 27.3,38.73 v24.13,35.56
D2_ENC2  (via drill 0.5)
  Top 0.254: v25.4,39.37 25.4,38.8 U1.36
  Bottom 0.254: JP23.4 40.01,57.78 28.57,57.78 27.94,57.15 27.94,48.9 26.67,47.62 26.67,40.64 v25.4,39.37
D2_GMOT  (via drill 0.5)
  Top 0.61: D2.1 34.29,72.39 34.92,71.75 U$26.P$1
  Top 1.676: JP8.2 3.81,77.47 4.43,76.85 X3.2 8.27,76.85 10.16,78.74 v31.75,78.74 v33.02,78.74 v34.29,78.74 | JP21.2 46.99,77.47 46.51,76.99 X8.1 43.02,76.99 41.27,78.74 v36.83,78.74 | v34.29,78.74 v35.56,78.74 v36.83,78.74 | C13.- 32.56,62.41 35.56,65.41 v35.56,66.04 v35.56,67.31 U$26.P$1 35.56,77.47 | v36.83,78.74 35.56,77.47 | v34.29,78.74 35.56,77.47
  other vias: 35.56,64.77 36.83,66.04 36.83,64.77 34.29,64.77 34.29,66.04 33.02,66.04 33.02,64.77 31.75,64.77 31.75,66.04
  pour Route2 (isolate 0.305): 38.1,85.09 52.07,85.09 52.07,67.31 38.1,67.31
  pour Route3 (isolate 0.305): 38.1,85.09 52.07,85.09 52.07,67.31 38.1,67.31
  pour Top (isolate 0.406): -1.27,78.74 52.07,78.74 52.07,74.93 39.37,74.93 39.37,57.15 -1.27,57.15
  pour Bottom (isolate 0.406): -1.27,85.09 39.37,85.09 39.37,57.15 -1.27,57.15
D2_IN1  (via drill 0.5)
  Top 0.254: D2.3 v31.11,69.85 | U1.34 23.98,37.31 v23.5,36.83
  Bottom 0.254: v31.11,69.85 26.67,69.85 24.77,67.94 24.77,40.64 23.81,39.69 23.81,37.15 v23.5,36.83
D2_IN2  (via drill 0.5)
  Top 0.254: D2.2 v31.11,71.12 | U1.35 23.2,37.81 v22.23,36.83
  Bottom 0.254: v31.11,71.12 26.67,71.12 24.13,68.58 24.13,41.27 23.18,40.32 23.18,37.78 v22.23,36.83
D2_MAX  (via drill 0.5)
  Top 0.254: v26.67,48.9 26.67,42.55 24.34,40.22 U1.37
  Bottom 0.254: JP25.3 43.18,61.59 41.27,59.69 40.01,59.69 38.73,58.42 27.94,58.42 27.3,57.78 27.3,49.53 v26.67,48.9
D2_MIN  (via drill 0.5)
  Top 0.254: U1.38 23.84,40.98 v25.72,42.86
  Bottom 0.254: JP24.3 41.91,63.5 41.91,61.59 40.64,60.33 39.37,60.33 38.1,59.05 27.3,59.05 25.72,57.47 v25.72,42.86
D2_OUT1
  Top 0.61: D2.6 40.01,69.85 40.64,69.22
  Top 1.676: JP22.1 46.99,69.85 46.51,69.37 X9.1 44.3,69.22 40.64,69.22
D2_OUT2
  Top 0.61: D2.8 40.01,72.39 40.64,73.03
  Top 1.676: JP22.2 46.99,72.39 46.51,72.87 X9.2 44.3,73.03 40.64,73.03
D2_STEP  (via drill 0.5)
  Top 0.254: U1.2 16.16,37.81 15.88,38.1 v15.88,40.01
  Top 0.61: X3.7 2.88,59.35 JP3.5
  Bottom 0.254: X3.7 7.96,59.35 8.89,58.42 8.89,46.99 9.53,46.35 10.79,46.35 13.97,43.18 13.97,41.91 v15.88,40.01
D2_VMOT  (via drill 0.8)
  Top 0.61: D2.5 38.73,68.58 39.37,67.94 v39.37,67.31
  Top 1.676: JP8.1 3.81,80.01 4.15,80.35 X3.1 7.96,80.35 8.89,81.28 v38.1,81.28 | X8.2 46.51,80.49 46.99,80.01 JP21.1 | v39.37,67.31 39.37,63.04 C13.+
  Bottom 1.676: X8.2 42.7,80.49 41.91,81.28 40.64,81.28 | 40.64,81.28 v38.1,81.28 39.37,80.01 | 40.64,81.28 39.37,80.01 | 39.37,80.01 v39.37,67.31
  pour Top (isolate 0.305): -1.27,82.55 52.07,82.55 52.07,80.01 -1.27,80.01
D2_VREF
  Top 0.254: D2.4 30.19,68.58 U4.1
DTR  (via drill 0.5)
  Top 0.254: D3.C v15.24,10.16
  Route3 0.254: v15.24,10.16 13.97,11.43 13.97,17.78 JP12.6
GND  (via drill 0.5, 0.8)
  Top 0.254: U4.6 30.16,67 29.21,67.94 U4.2 | U2.6 30.16,11.12 29.21,12.06 U2.2 | U1.5 16.39,36.31 v15.88,36.83 | 22.34,40.76 22.86,41.27
  Top 0.305: U1.41 22.34,40.76
  Top 0.406: U5.4 16.8,16.8 | S2.2 24.13,7.62 v24.13,10.16 S2.1 | S1.2 23.5,15.24 v23.5,17.78 S1.1 28.57,19.05 29.43,18.2 C6.2 C5.2 29.21,14.39 U2.2 | v29.21,74.93 29.43,74.72 C10.2 C9.2 29.21,70.27 U4.2 | U3.2 29.21,42.33 C7.2 C8.2 29.43,46.57 v29.84,46.99 | Q2.2 16.19,61.91 v16.51,62.23 | Q3.2 21.27,61.91 v21.59,62.23 | v12.7,32.38 12.06,32.38 11.43,33.02 11.43,33.44 C3.1 C2.1
  Top 0.61: 16.8,16.8 16.51,16.51 | 22.86,41.27 24.13,42.55 24.13,43.18 22.86,44.45 C4.1 22.44,45.51 v22.23,45.72 | C1.1 12.91,42.76 v12.7,42.55
  Top 0.813: X1.4 5.08,13.97 JP1.2 | X2.4 5.08,41.91 JP2.2 | X3.4 5.08,69.85 JP3.2 | JP18.2 JP20.2 JP19.2 | JP13.2 JP15.2 JP14.2 | JP23.2 JP25.2 JP24.2
  Top 1.676: D0.PAD U$22.P$2 35.56,17.78 | 35.56,41.91 U$24.P$2 35.56,45.72 34.29,46.99 | 35.56,41.91 D1.PAD | D2.PAD 35.56,71.12 | D2.PAD U$25.P$2 35.56,73.66 34.29,74.93 | U$23.P$2 D1.PAD | D0_GMOT.P$2 35.56,15.24 | 35.56,15.24 D0.PAD | 16.51,16.51 15.37,16.51 C15.2 15.24,18.92 C14.2 15.11,20.82 v15.24,20.95 | U$26.P$2 35.56,71.12 | 35.56,71.12 v34.92,70.48 | D2.PAD v36.2,70.48 | v34.92,42.55 35.56,41.91 | v34.92,14.61 35.56,15.24 | D0.PAD v36.2,14.61 | D1.PAD v36.2,42.55 | 35.56,17.78 35.56,20.32 34.29,19.05 | 35.56,17.78 34.29,19.05 | 34.29,19.05 33.4,19.05 R1.1 | 35.56,48.26 34.29,46.99 | 34.29,46.99 33.4,46.99 R2.1 | 35.56,76.2 34.29,74.93 | 34.29,74.93 33.4,74.93 R3.1
  Bottom 0.254: R6.1 24.34,32.17 v23.5,33.02 R7.1 | R8.1 20.95,44.45 v22.23,45.72
  Bottom 0.406: R9.1 13.76,29.43 12.7,30.48 v12.7,32.38
  pour Route2 (isolate 0.305): -1.27,-1.27 52.07,-1.27 52.07,10.16 36.83,10.16 36.83,27.94 52.07,27.94 52.07,38.1 36.83,38.1 36.83,55.88 52.07,55.88 52.07,66.04 36.83,66.04 36.83,85.09 -1.27,85.09
ISP  (via drill 0.5)
  Top 0.254: 19.05,5.08 R5.1 | v22.23,20.32 22.23,12.7 21.59,12.06 S2.3 S2.4 20.32,5.08 R5.1 | U1.4 18.43,36.81 19.68,35.56 20.32,35.56 v21.59,34.29 | R5.1 18.63,4.66 17.78,3.81 15.88,3.81 15.24,4.45 D4.A
  Bottom 0.254: v21.59,34.29 20.95,33.66 20.95,30.48 18.41,27.94 18.41,24.77 22.23,20.95 v22.23,20.32
LED0  (via drill 0.5)
  Top 0.254: U1.45 20.34,42.52 v17.78,45.09 | v17.78,55.88 17.78,57.37 R11.2
  Bottom 0.254: v17.78,45.09 16.51,46.35 16.51,54.61 v17.78,55.88
LED1  (via drill 0.5)
  Top 0.254: U1.42 21.84,42.16 v22.23,42.55 | v21.59,55.88 21.59,56.94 R13.2
  Bottom 0.254: v21.59,55.88 21.59,47.62 23.5,45.72 23.5,43.81 v22.23,42.55
N$1
  Top 0.406: R10.2 14.82,64.33 LED1.A
N$2
  Top 0.406: LED1.C 12.92,61.01 Q2.3
N$6
  Top 0.406: R11.1 15.66,59.42 Q2.1
N$7
  Top 0.406: R13.1 20.74,59.42 Q3.1
N$9
  Top 0.406: R12.2 19.9,64.33 LED2.A
N$10
  Top 0.406: LED2.C 18,61.01 Q3.3
PWRREG_C+
  Top 0.406: U5.6 18.09,11.38 C16.1
PWRREG_C-
  Top 0.406: U5.5 17.44,11.36 C16.2
RESET  (via drill 0.5)
  Top 0.254: S1.3 S1.4 20.95,13.34 20.32,12.7 20.32,9.31 R4.1 17.36,8.89 16.51,8.89 15.24,7.62 D3.A | U5.1 19.39,18.12 20.32,19.05 S1.3 | S1.3 v20.95,20.95 | U1.3 18.89,37.31 v19.05,37.47
  Bottom 0.254: v20.95,20.95 17.78,24.13 17.78,34.29 19.05,35.56 v19.05,37.47
RTS
  Top 0.254: D4.C 14.64,6.95 JP12.2
RXD  (via drill 0.5)
  Top 0.254: v17.78,43.18 18.41,43.18 19.84,41.76 U1.46
  Bottom 0.254: JP12.4 13.97,15.24 13.97,21.59 17.14,24.77 17.14,34.92 17.78,35.56 v17.78,43.18
SCL  (via drill 0.5)
  Top 0.254: U1.15 19.84,33.5 v19.05,34.29 | v19.05,46.99 21.59,46.99 JP4.4 | JP26.4 R14.1
  Route3 0.254: JP5.4 21.59,3.81 12.7,3.81 11.43,5.08 11.43,44.45 13.97,46.99 21.59,46.99 JP4.4
  Bottom 0.254: JP26.4 JP4.4 | v19.05,34.29 20.32,35.56 20.32,39.37 19.05,40.64 v19.05,46.99
SDA  (via drill 0.5)
  Top 0.254: U1.16 20.34,34.27 v20.32,34.29 | JP26.3 20.32,73.88 R15.1
  Route3 0.254: JP5.3 19.05,1.27 12.7,1.27 10.16,3.81 10.16,45.72 13.97,49.53 19.05,49.53 JP4.3
  Bottom 0.254: JP26.3 JP4.3 20.32,46.99 19.68,46.35 19.68,41.27 20.95,40.01 20.95,34.92 v20.32,34.29
TXD  (via drill 0.5)
  Top 0.254: v16.51,43.18 17.78,41.91 18.41,41.91 19.34,40.98 U1.47
  Bottom 0.254: JP12.5 11.43,17.78 11.43,20.32 16.51,25.4 16.51,35.56 17.14,36.2 17.14,42.55 v16.51,43.18
VCC  (via drill 0.5, 0.8)
  Top 0.254: U3.6 30.16,39.05 29.84,39.37 28.57,39.37 28.26,39.69 U3.3 | R5.2 16.51,5.08 v16.51,6.35 16.51,7.62 R4.2 | U1.44 20.84,41.16 20.95,41.27 | U1.8 14.09,34.81 13.97,34.92
  Top 0.406: U5.2 18.74,18.22 C14.1 | v24.77,17.14 C6.1 C5.1 28.26,14.07 U2.3 | v27.94,74.93 27.73,74.72 C10.1 C9.1 28.26,69.95 U4.3 | U3.3 28.26,42.01 C7.1 C8.1 27.73,46.14 v28.57,46.99 | 20.95,41.27 20.95,43.18 | R10.1 13.12,67.73 v13.34,67.94 | R12.1 18.2,67.73 v18.41,67.94 | v13.97,31.75 13.97,32.6 C3.2 12.91,34.51 13.34,34.92 13.97,34.92
  Top 0.61: v20.95,45.72 20.74,45.51 C4.2 20.84,44.35 20.84,43.3 20.95,43.18
  Top 0.813: JP18.1 JP20.1 JP19.1 | JP13.1 JP15.1 JP14.1 | JP23.1 JP25.1 JP24.1
  Top 1.676: C14.1 17.78,19.18 v17.78,20.95
  pour Route3 (isolate 0.305): 24.13,-1.27 52.07,-1.27 52.07,10.16 36.83,10.16 36.83,27.94 52.07,27.94 52.07,38.1 36.83,38.1 36.83,55.88 52.07,55.88 52.07,66.04 36.83,66.04 36.83,85.09 12.06,85.09 12.06,19.05 16.51,19.05 16.51,4.45 24.13,4.45
VDD
  Top 0.406: JP26.1 15.24,74.93 16.51,73.66 R15.2 20.32,72.17 R14.2
  Route3 0.406: JP4.1 13.97,48.26 10.79,45.09 10.79,4.45 12.7,2.54 JP5.1
  Bottom 0.406: JP4.1 JP26.1
VIN
  Top 0.254: U5.8 19.39,14.27 19.05,14.61 18.41,14.61 18.74,14.28 U5.7
  Top 0.406: U5.3 18.09,14.93 18.41,14.61
  Top 0.813: X1.3 6.04,17.47 JP1.1 | X2.3 6.04,45.41 JP2.1 | X3.3 6.04,73.35 JP3.1
  Top 1.676: 18.41,14.61 16.51,14.61 15.74,13.84 C15.1 15.24,12.7 13.97,11.43 JP12.3 11.43,11.43 10.16,12.7 10.16,15.24 8.89,16.51 7.31,16.51 X1.3
  pour Route3: -1.27,85.09 9.53,85.09 9.53,-1.27 -1.27,-1.27
XTALIN
  Top 0.254: U1.6 15.62,35.81 14.61,36.83 14.61,39.37 13.97,40.01 12.06,40.01 11.43,40.64 11.43,40.94 Y1.2
  Top 0.61: C1.2 11.21,41.16 Y1.2
XTALOUT
  Top 0.254: U1.7 14.86,35.31 13.97,36.2 13.97,37.8 Y1.1
  Top 0.61: Y1.1 12.87,36.24 C2.2

### Text on the board
tNames: SmoothieDriver Triple H-Bridge | DC Motor Servo Controller | Prototype 2 | http://www.smoothieware.org/ | Produced by TrinityLabs | http://www.trinitylabs.com/ | Designed by Logxen | with the help of the RepRap community